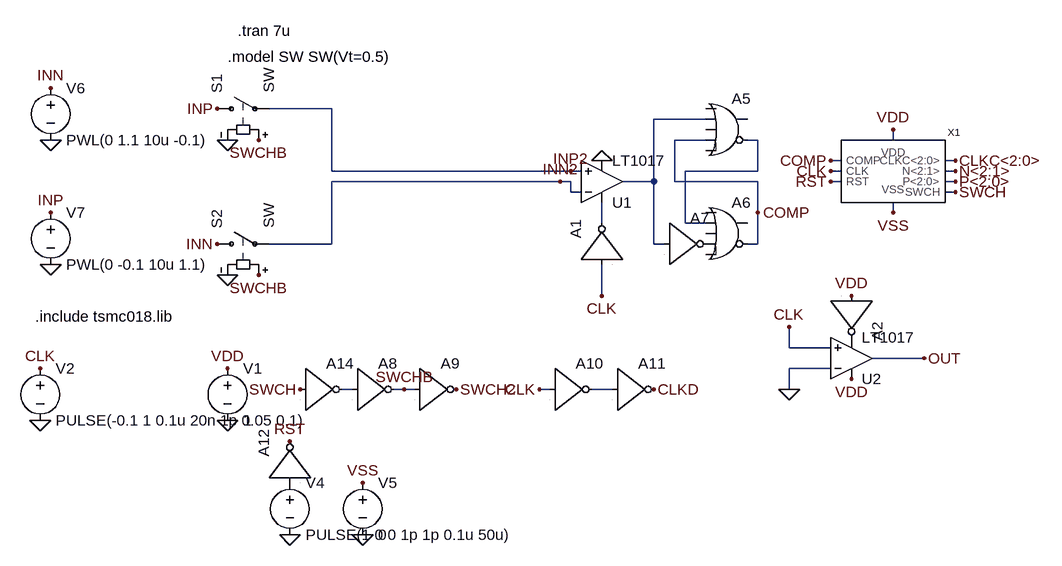
[diagram p0: schematic test_comp_SAR_3bit.asc]
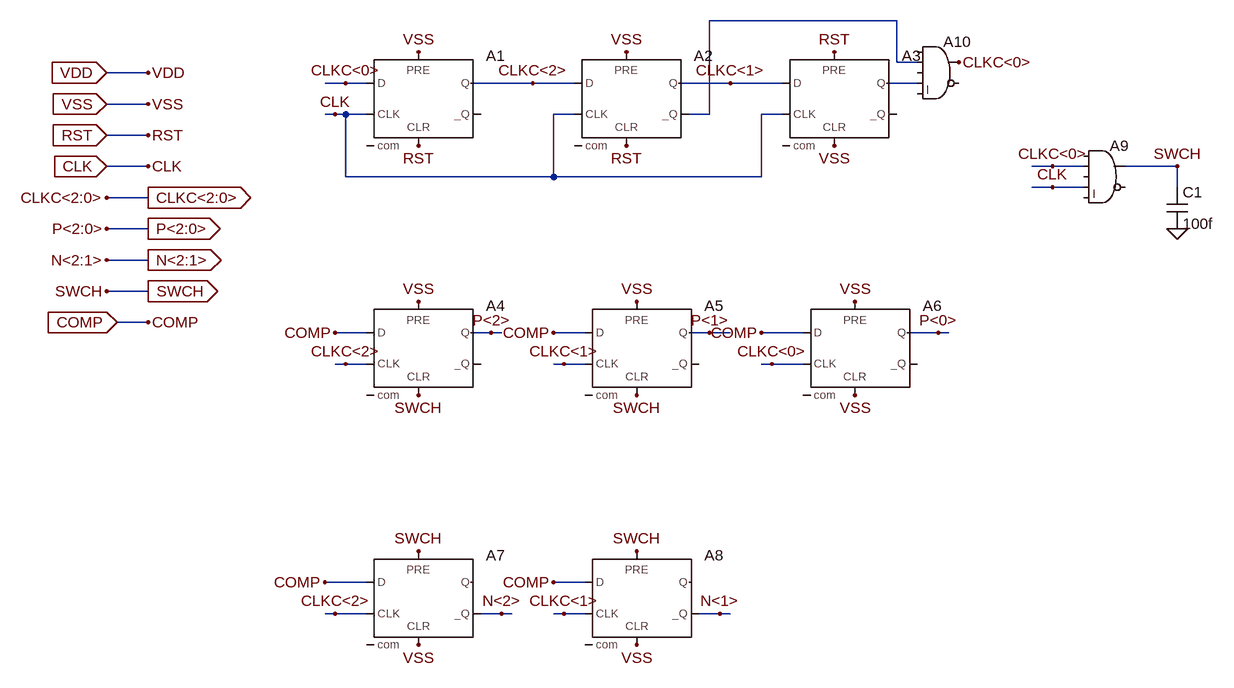
[diagram p1: sub-circuit 3bit_sar_logic.asc]
test_comp_SAR_3bit.asc, the LTspice schematic file:
Version 4
SHEET 1 1368 988
WIRE 320 128 224 128
WIRE 896 144 816 144
WIRE 896 176 848 176
WIRE 976 176 960 176
WIRE 1184 176 1184 160
WIRE 1104 208 1088 208
WIRE 1280 208 1264 208
WIRE 320 224 320 128
WIRE 688 224 320 224
WIRE 704 224 688 224
WIRE 976 224 976 176
WIRE 976 224 864 224
WIRE 1104 224 1088 224
WIRE 1280 224 1264 224
WIRE 672 240 320 240
WIRE 688 240 672 240
WIRE 816 240 816 144
WIRE 816 240 768 240
WIRE 848 240 848 176
WIRE 976 240 848 240
WIRE 1104 240 1088 240
WIRE 1280 240 1264 240
WIRE 688 256 688 240
WIRE 704 256 688 256
WIRE 1280 256 1264 256
WIRE 976 288 976 240
WIRE 1184 288 1184 272
WIRE 736 304 736 272
WIRE 864 304 864 224
WIRE 896 304 864 304
WIRE 320 336 320 240
WIRE 320 336 224 336
WIRE 816 336 816 240
WIRE 832 336 816 336
WIRE 976 336 976 288
WIRE 976 336 960 336
WIRE 736 416 736 368
WIRE 1024 496 1024 464
WIRE 1088 496 1024 496
WIRE 1232 512 1152 512
WIRE 1088 528 1024 528
WIRE 352 560 336 560
WIRE 432 560 416 560
WIRE 448 560 432 560
WIRE 656 560 640 560
WIRE 752 560 720 560
WIRE 1024 560 1024 528
FLAG 736 208 0
FLAG 144 128 INP
FLAG 160 608 0
FLAG 160 528 VDD
FLAG 1088 208 COMP
FLAG 976 288 COMP
FLAG 1088 224 CLK
FLAG 1088 240 RST
FLAG 1184 160 VDD
FLAG 1184 288 VSS
FLAG 208 384 SWCHB
FLAG 432 560 SWCHB
FLAG 512 560 SWCH2
FLAG 640 560 CLK
FLAG 816 560 CLKD
FLAG 1280 208 CLKC<2:0>
FLAG 1280 224 N<2:1>
FLAG 1280 240 P<2:0>
FLAG 1280 256 SWCH
FLAG -128 608 0
FLAG -128 528 CLK
FLAG 256 784 0
FLAG 368 784 0
FLAG 368 704 VSS
FLAG -112 176 0
FLAG -112 96 INN
FLAG -112 368 0
FLAG -112 288 INP
FLAG 688 224 INP2
FLAG 672 240 INN2
FLAG 256 640 RST
FLAG 144 336 INN
FLAG 160 384 0
FLAG 160 176 0
FLAG 208 176 SWCHB
FLAG 272 560 SWCH
FLAG 736 416 CLK
FLAG 1024 464 CLK
FLAG 1024 560 0
FLAG 1120 544 VDD
FLAG 1232 512 OUT
FLAG 1120 416 VDD
SYMBOL Digital\\or 928 96 R0
SYMATTR InstName A5
SYMATTR SpiceLine Trise 1n Tfall 1n
SYMBOL Digital\\or 928 256 R0
SYMATTR InstName A6
SYMATTR SpiceLine Trise 1n Tfall 1n
SYMBOL Comparators\\LT1017 736 240 M180
SYMATTR InstName U1
SYMBOL voltage 160 512 R0
WINDOW 123 0 0 Left 0
WINDOW 39 0 0 Left 0
SYMATTR InstName V1
SYMATTR Value 1
SYMBOL Digital\\inv 832 272 R0
SYMATTR InstName A7
SYMATTR SpiceLine Trise 1n Tfall 1n
SYMBOL 3bit_SAR_logic 1184 224 R0
SYMATTR InstName X1
SYMBOL Digital\\inv 352 496 R0
SYMATTR InstName A8
SYMATTR SpiceLine Trise 1n Tfall 1n
SYMBOL Digital\\inv 448 496 R0
SYMATTR InstName A9
SYMATTR SpiceLine Trise 1n Tfall 1n
SYMBOL Digital\\inv 656 496 R0
SYMATTR InstName A10
SYMBOL Digital\\inv 752 496 R0
SYMATTR InstName A11
SYMBOL voltage -128 512 R0
WINDOW 123 0 0 Left 0
WINDOW 39 0 0 Left 0
SYMATTR InstName V2
SYMATTR Value PULSE(-0.1 1 0.1u 20n 1p 0.05 0.1)
SYMBOL voltage 256 688 R0
WINDOW 123 0 0 Left 0
WINDOW 39 0 0 Left 0
SYMATTR InstName V4
SYMATTR Value PULSE(1 0 0 1p 1p 0.1u 50u)
SYMBOL voltage 368 688 R0
WINDOW 123 0 0 Left 0
WINDOW 39 0 0 Left 0
SYMATTR InstName V5
SYMATTR Value 0
SYMBOL voltage -112 80 R0
WINDOW 123 0 0 Left 0
WINDOW 39 0 0 Left 0
SYMATTR InstName V6
SYMATTR Value PWL(0 1.1 10u -0.1)
SYMBOL voltage -112 272 R0
WINDOW 123 0 0 Left 0
WINDOW 39 0 0 Left 0
SYMATTR InstName V7
SYMATTR Value PWL(0 -0.1 10u 1.1)
SYMBOL Digital\\inv 192 704 R270
SYMATTR InstName A12
SYMATTR SpiceLine Trise 10n Tfall 10n
SYMBOL sw 128 128 R270
SYMATTR InstName S1
SYMBOL sw 128 336 R270
SYMATTR InstName S2
SYMBOL Digital\\inv 272 496 R0
SYMATTR InstName A14
SYMATTR SpiceLine Trise 1n Tfall 1n
SYMBOL Digital\\inv 672 368 R270
SYMATTR InstName A1
SYMBOL Comparators\\LT1017 1120 512 M180
SYMATTR InstName U2
SYMBOL Digital\\inv 1184 416 R90
SYMATTR InstName A2
TEXT -136 448 Left 2 !.include tsmc018.lib
TEXT 160 48 Left 2 !.model SW SW(Vt=0.5)
TEXT 176 8 Left 2 !.tran 7u

3bit_sar_logic.asc, the sub-circuit schematic file:
Version 4
SHEET 1 1780 984
WIRE 880 -32 592 -32
WIRE 880 32 880 -32
WIRE 912 32 880 32
WIRE -272 48 -336 48
WIRE 32 64 0 64
WIRE 64 64 32 64
WIRE 320 64 224 64
WIRE 384 64 320 64
WIRE 624 64 544 64
WIRE 704 64 624 64
WIRE 912 64 864 64
WIRE -272 96 -336 96
WIRE 16 112 0 112
WIRE 32 112 16 112
WIRE 64 112 32 112
WIRE 384 112 352 112
WIRE 592 112 592 -32
WIRE 592 112 560 112
WIRE 704 112 672 112
WIRE -272 144 -336 144
WIRE -272 192 -336 192
WIRE 1120 192 1088 192
WIRE 1168 192 1120 192
WIRE 1312 192 1232 192
WIRE 32 208 32 112
WIRE 352 208 352 112
WIRE 352 208 32 208
WIRE 672 208 672 112
WIRE 672 208 352 208
WIRE 1120 224 1088 224
WIRE 1168 224 1120 224
WIRE 1312 224 1312 192
WIRE -272 240 -336 240
WIRE -272 288 -336 288
WIRE -272 336 -336 336
WIRE -272 384 -336 384
WIRE -272 432 -320 432
WIRE 64 448 16 448
WIRE 256 448 224 448
WIRE 272 448 256 448
WIRE 400 448 352 448
WIRE 592 448 560 448
WIRE 624 448 592 448
WIRE 736 448 672 448
WIRE 944 448 896 448
WIRE 960 448 944 448
WIRE 32 496 16 496
WIRE 64 496 32 496
WIRE 368 496 352 496
WIRE 400 496 368 496
WIRE 688 496 672 496
WIRE 736 496 688 496
WIRE 64 832 0 832
WIRE 400 832 352 832
WIRE 16 880 0 880
WIRE 64 880 16 880
WIRE 272 880 240 880
WIRE 288 880 272 880
WIRE 368 880 352 880
WIRE 400 880 368 880
WIRE 608 880 576 880
WIRE 624 880 608 880
FLAG 32 64 CLKC<0>
FLAG 320 64 CLKC<2>
FLAG 624 64 CLKC<1>
FLAG 16 112 CLK
FLAG 144 400 VSS
FLAG 816 400 VSS
FLAG 480 400 VSS
FLAG 816 544 VSS
FLAG 144 784 SWCH
FLAG 480 784 SWCH
FLAG 256 448 P<2>
FLAG 592 448 P<1>
FLAG 944 448 P<0>
FLAG 32 496 CLKC<2>
FLAG 368 496 CLKC<1>
FLAG 688 496 CLKC<0>
FLAG 16 880 CLKC<2>
FLAG 368 880 CLKC<1>
FLAG 272 880 N<2>
FLAG 608 880 N<1>
FLAG 1120 192 CLKC<0>
FLAG 1120 224 CLK
FLAG -336 48 VDD
IOPIN -336 48 In
FLAG -336 96 VSS
IOPIN -336 96 In
FLAG -336 144 RST
IOPIN -336 144 In
FLAG -336 192 CLK
IOPIN -336 192 In
FLAG -272 96 VSS
FLAG -272 192 CLK
FLAG -272 240 CLKC<2:0>
IOPIN -272 240 Out
FLAG -272 288 P<2:0>
IOPIN -272 288 Out
FLAG -272 336 N<2:1>
IOPIN -272 336 Out
FLAG -272 384 SWCH
IOPIN -272 384 Out
FLAG -336 240 CLKC<2:0>
FLAG -336 288 P<2:0>
FLAG -336 336 N<2:1>
FLAG -336 384 SWCH
FLAG 784 160 VSS
FLAG 144 160 RST
FLAG 464 160 RST
FLAG 144 16 VSS
FLAG 464 16 VSS
FLAG 784 16 RST
FLAG 352 448 COMP
FLAG 672 448 COMP
FLAG 352 832 COMP
FLAG 0 832 COMP
FLAG 16 448 COMP
FLAG -320 432 COMP
IOPIN -320 432 In
FLAG -272 432 COMP
FLAG -272 144 RST
FLAG -272 48 VDD
FLAG 976 32 CLKC<0>
FLAG 1312 288 0
FLAG 144 544 SWCH
FLAG 480 544 SWCH
FLAG 144 928 VSS
FLAG 480 928 VSS
FLAG 1312 192 SWCH
SYMBOL Digital\\dflop 144 16 R0
SYMATTR InstName A1
SYMATTR SpiceLine Trise 1n
SYMBOL Digital\\dflop 464 16 R0
SYMATTR InstName A2
SYMATTR SpiceLine Trise 1n
SYMBOL Digital\\dflop 784 16 R0
SYMATTR InstName A3
SYMATTR SpiceLine Trise 1n
SYMBOL Digital\\dflop 144 400 R0
SYMATTR InstName A4
SYMATTR SpiceLine Trise 10n Tfall 10n
SYMBOL Digital\\dflop 480 400 R0
SYMATTR InstName A5
SYMATTR SpiceLine Trise 10n Tfall 10n
SYMBOL Digital\\dflop 816 400 R0
SYMATTR InstName A6
SYMATTR SpiceLine Trise 10n Tfall 10n
SYMBOL Digital\\dflop 144 784 R0
SYMATTR InstName A7
SYMATTR SpiceLine Trise 10n Tfall 10n
SYMBOL Digital\\dflop 480 784 R0
SYMATTR InstName A8
SYMATTR SpiceLine Trise 10n Tfall 10n
SYMBOL Digital\\and 1200 144 R0
SYMATTR InstName A9
SYMATTR SpiceLine Trise 10n Tfall 10n
SYMBOL Digital\\and 944 -16 R0
SYMATTR InstName A10
SYMATTR SpiceLine Trise 1n
SYMBOL cap 1296 224 R0
SYMATTR InstName C1
SYMATTR Value 100f

The netlist it stands for:
* test_comp_SAR_3bit.asc
A5 0 N001 0 COMP 0 N002 0 0 OR Trise 1n Tfall 1n
A6 0 N002 0 P001 0 COMP 0 0 OR Trise 1n Tfall 1n
XU1 INP2 INN2 N003 0 N001 LT1017  ; pins In+ In- V+ V- OUT
V1 VDD 0 1
A7 N001 0 0 0 0 P001 0 0 BUF Trise 1n Tfall 1n
XX1 COMP CLK RST CLKC<2:0> N<2:1> P<2:0> SWCH VDD VSS 3bit_sar_logic
A8 N004 0 0 0 0 SWCHB 0 0 BUF Trise 1n Tfall 1n
A9 SWCHB 0 0 0 0 SWCH2 0 0 BUF Trise 1n Tfall 1n
A10 CLK 0 0 0 0 N005 0 0 BUF
A11 N005 0 0 0 0 CLKD 0 0 BUF
V2 CLK 0 PULSE(-0.1 1 0.1u 20n 1p 0.05 0.1)
V4 P002 0 PULSE(1 0 0 1p 1p 0.1u 50u)
V5 VSS 0 0
V6 INN 0 PWL(0 1.1 10u -0.1)
V7 INP 0 PWL(0 -0.1 10u 1.1)
A12 P002 0 0 0 0 RST 0 0 BUF Trise 10n Tfall 10n
S1 INP INP2 SWCHB 0 SW
S2 INN INN2 SWCHB 0 SW
A14 SWCH 0 0 0 0 N004 0 0 BUF Trise 1n Tfall 1n
A1 CLK 0 0 0 0 N003 0 0 BUF
XU2 CLK 0 VDD P003 OUT LT1017  ; pins In+ In- V+ V- OUT
A2 VDD 0 0 0 0 P003 0 0 BUF

* block symbol definitions
.subckt 3bit_sar_logic COMP CLK RST CLKC<2:0> N<2:1> P<2:0> SWCH VDD VSS
A1 CLKC<0> 0 CLK VSS RST 0 CLKC<2> 0 DFLOP Trise 1n
A2 CLKC<2> 0 CLK VSS RST N001 CLKC<1> 0 DFLOP Trise 1n
A3 CLKC<1> 0 CLK RST VSS 0 N002 0 DFLOP Trise 1n
A4 COMP 0 CLKC<2> VSS SWCH 0 P<2> 0 DFLOP Trise 10n Tfall 10n
A5 COMP 0 CLKC<1> VSS SWCH 0 P<1> 0 DFLOP Trise 10n Tfall 10n
A6 COMP 0 CLKC<0> VSS VSS 0 P<0> 0 DFLOP Trise 10n Tfall 10n
A7 COMP 0 CLKC<2> SWCH VSS N<2> 0 0 DFLOP Trise 10n Tfall 10n
A8 COMP 0 CLKC<1> SWCH VSS N<1> 0 0 DFLOP Trise 10n Tfall 10n
A9 0 CLKC<0> 0 CLK 0 0 SWCH 0 AND Trise 10n Tfall 10n
A10 0 N001 0 N002 0 0 CLKC<0> 0 AND Trise 1n
C1 SWCH 0 100f
.ends 3bit_sar_logic

.include tsmc018.lib
.model SW SW(Vt=0.5)
.tran 7u
.backanno
.end